# EAGLE design AutoDuctMainboard_v1.1 (EAGLE 8.5.1)
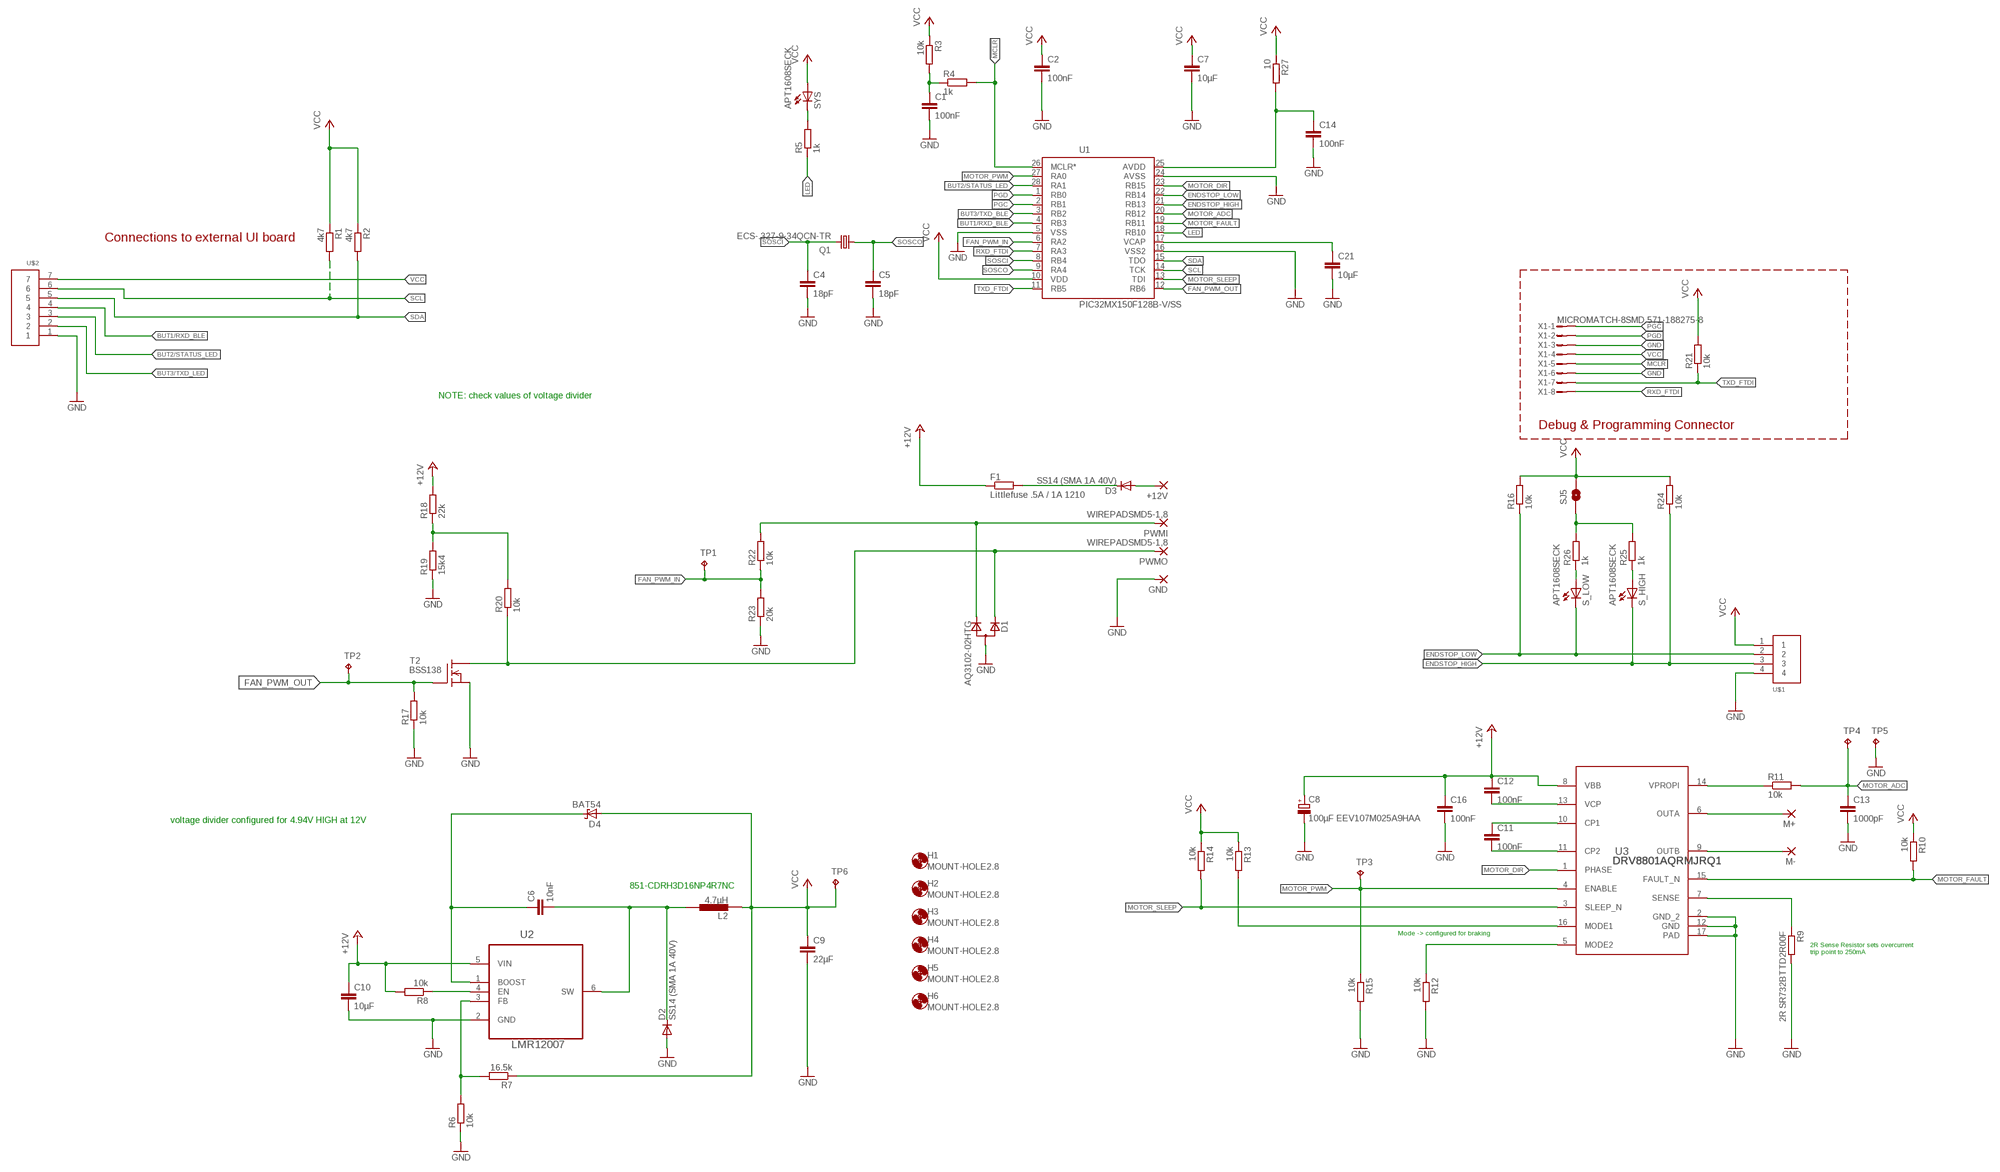
[diagram p0: schematic, sheet 1]

## Parts
+12V  SMD5  [SMD2,54-5,08]
C1  100nF  C-EUC0402  [C0402]
C2  100nF  C-EUC0402  [C0402]
C4  18pF  C-EUC0603K  [C0603K]
C5  18pF  C-EUC0603K  [C0603K]
C6  10nF  C-EUC0603K  [C0603K]
C7  10µF  C-EUC0603K  [C0603K]
C8  100µF EEV107M025A9HAA  CPOL-EU153CLV-0605  [153CLV-0605]
C9  22µF  C-EUC0805K  [C0805K]
C10  10µF  C-EUC1206K  [C1206K]
C11  100nF  C-EUC0402  [C0402]
C12  100nF  C-EUC0402  [C0402]
C13  1000pF  C-EUC0603K  [C0603K]
C14  100nF  C-EUC0402  [C0402]
C16  100nF  C-EUC0603K  [C0603K]
C21  10µF  C-EUC0603K  [C0603K]
D1  AQ3102-02HTG  D_2CSOT323  [SOT323]
D2  SS14 (SMA 1A 40V)  DIODE-DO214AC  [DO214AC]
D3  SS14 (SMA 1A 40V)  DIODE-DO214AC  [DO214AC]
D4  BAT54  [SOT23]
F1  Littlefuse .5A / 1A 1210  R-EU_R1210  [R1210]
GND  SMD5  [SMD2,54-5,08]
H1  MOUNT-HOLE2.8  [2,8]
H2  MOUNT-HOLE2.8  [2,8]
H3  MOUNT-HOLE2.8  [2,8]
H4  MOUNT-HOLE2.8  [2,8]
H5  MOUNT-HOLE2.8  [2,8]
H6  MOUNT-HOLE2.8  [2,8]
L2  4.7µH  CDRH3D16  [CDRH3D16]
M+  SMD5  [SMD2,54-5,08]
M-  SMD5  [SMD2,54-5,08]
PWMI  WIREPADSMD5-1,8  [5-1,8]
PWMO  WIREPADSMD5-1,8  [5-1,8]
Q1  ECS-.327-9-34QCN-TR  KX-327-NHF  [3.2X1.5]
R1  4k7  R-EU_R0603  [R0603]
R2  4k7  R-EU_R0603  [R0603]
R3  10k  R-EU_R0603  [R0603]
R4  1k  R-EU_R0603  [R0603]
R5  1k  R-EU_R0603  [R0603]
R6  10k  R-EU_R0603  [R0603]
R7  16.5k  R-EU_R0603  [R0603]
R8  10k  R-EU_R0603  [R0603]
R9  2R SR732BTTD2R00F  R-EU_R1206  [R1206]
R10  10k  R-EU_R0603  [R0603]
R11  10k  R-EU_R0603  [R0603]
R12  10k  R-EU_R0603  [R0603]
R13  10k  R-EU_R0603  [R0603]
R14  10k  R-EU_R0603  [R0603]
R15  10k  R-EU_R0603  [R0603]
R16  10k  R-EU_R0603  [R0603]
R17  10k  R-EU_R0603  [R0603]
R18  22k  R-EU_R0603  [R0603]
R19  15k4  R-EU_R0603  [R0603]
R20  10k  R-EU_R0603  [R0603]
R21  10k  R-EU_R0603  [R0603]
R22  10k  R-EU_R0603  [R0603]
R23  20k  R-EU_R0603  [R0603]
R24  10k  R-EU_R0603  [R0603]
R25  1k  R-EU_R0603  [R0603]
R26  1k  R-EU_R0603  [R0603]
R27  10  R-EU_R0603  [R0603]
S_HIGH  APT1608SECK  LEDCHIPLED_0603  [CHIPLED_0603]
S_LOW  APT1608SECK  LEDCHIPLED_0603  [CHIPLED_0603]
SJ5  RXLED  SOLDERJUMPERNO  [SJ_2S-NO]
SYS  APT1608SECK  LEDCHIPLED_0603  [CHIPLED_0603]
T2  BSS138  [SOT23]
TP1  TPTP13R  [TP13R]
TP2  TPTP13R  [TP13R]
TP3  TPTP13R  [TP13R]
TP4  TPTP09R  [TP09R]
TP5  TPTP12SQ  [TP12SQ]
TP6  TPTP13R  [TP13R]
U1  PIC32MX150F128B-V/SS  PIC32MX130F064B-V/ML  [QFN65P600X600X100-29N]
U2  LMR12007  [SOT95P285X100-6N]
U3  DRV8801AQRMJRQ1  [RMJ0016A]
U$1  WIREPAD1X4  [WIREPAD1X4]
U$2  WIREPAD1X7  [WIREPAD1X7]
X1  MICROMATCH-8SMD 571-188275-8  MICROMATCH-8SMD  [MICROMATCH-8-SMD]

## Nets
!MCLR: R4.2 U1.26(MCLR*) X1.5
+12V: C8.+ C10.1 C12.1 C16.1 F1.1 R8.2 R18.2 U2.5(VIN) U3.8(VBB)
BUT1/RXD_BLE: U1.4(RB3) U$2.4
BUT2/STATUS_LED: U1.28(RA1) U$2.3
BUT3/TXD_BLE: U1.3(RB2)
BUT3/TXD_LED: U$2.2
ENDSTOP_HIGH: R24.1 S_HIGH.C U1.21(RB13) U$1.3
ENDSTOP_LOW: R16.1 S_LOW.C U1.22(RB14) U$1.2
FAN_PWM_IN: R22.1 R23.2 TP1.TP U1.6(RA2)
FAN_PWM_IN_RAW: D1.3(C2) PWMI.1(P) R22.2
FAN_PWM_OUT: R17.2 T2.1(G) TP2.TP U1.12(RB6)
FAN_PWM_OUT_SHIFTED: D1.2(C1) PWMO.1(P) R20.1 T2.3(D)
GND: C1.2 C2.2 C4.2 C5.2 C7.2 C8.- C9.2 C10.2 C13.2 C14.2 C16.2 C21.2 D1.1(A) D2.A GND.1(P) R6.1 R9.2 R12.2 R15.2 R17.1 R19.1 R23.1 T2.2(S) TP5.TP U1.5(VSS) U1.16(VSS2) U1.24(AVSS) U2.2(GND) U3.2(GND_2) U3.12(GND) U3.17(PAD) U$1.4 U$2.1 X1.3 X1.6
LED: R5.1 U1.18(RB10)
MOTOR+: M+.1(P) U3.6(OUTA)
MOTOR-: M-.1(P) U3.9(OUTB)
MOTOR_ADC: C13.1 R11.2 TP4.TP U1.20(RB12)
MOTOR_DIR: U1.23(RB15) U3.1(PHASE)
MOTOR_FAULT: R10.2 U1.19(RB11) U3.15(FAULT_N)
MOTOR_PWM: R15.1 TP3.TP U1.27(RA0) U3.4(ENABLE)
MOTOR_SLEEP: R14.2 U1.13(TDI) U3.3(SLEEP_N)
N$1: R5.2 SYS.C
N$2: C1.1 R3.2 R4.1
N$3: R8.1 U2.4(EN)
N$4: C11.1 U3.10(CP1)
N$5: +12V.1(P) D3.A
N$6: C11.2 U3.11(CP2)
N$7: C6.1 D4.3(C) U2.1(BOOST)
N$8: C12.2 U3.13(VCP)
N$9: R6.2 R7.2 U2.3(FB)
N$10: C6.2 D2.C L2.2 U2.6(SW)
N$11: R13.2 U3.16(MODE1)
N$12: R12.1 U3.5(MODE2)
N$13: R25.2 R26.2 SJ5.1
N$14: R9.1 U3.7(SENSE)
N$15: R26.1 S_LOW.A
N$16: D3.C F1.2
N$18: R18.1 R19.2 R20.2
N$19: R11.1 U3.14(VPROPI)
N$20: R25.1 S_HIGH.A
N$22: C14.1 R27.2 U1.25(AVDD)
PGC: U1.2(RB1) X1.1
PGD: U1.1(RB0) X1.2
RXD_FTDI: U1.7(RA3) X1.8
SCL: R1.2 U1.14(TCK) U$2.6
SDA: R2.2 U1.15(TDO) U$2.5
SOSCI: C4.1 Q1.2 U1.8(RB4)
SOSCO: C5.1 Q1.1 U1.9(RA4)
TXD_FTDI: R21.1 U1.11(RB5) X1.7
VCAP: C21.1 U1.17(VCAP)
VCC: C2.1 C7.1 C9.1 D4.1(A) L2.1 R1.1 R2.1 R3.1 R7.1 R10.1 R13.1 R14.1 R16.2 R21.2 R24.2 R27.1 SJ5.2 SYS.A TP6.TP U1.10(VDD) U$1.1 U$2.7 X1.4

## Notes on the sheet
- Connections to external UI board
- NOTE: check values of voltage divider
- Debug & Programming Connector
- voltage divider configured for 4.94V HIGH at 12V
- 851-CDRH3D16NP4R7NC
- Mode -> configured for braking
- 2R Sense Resistor sets overcurrent
  trip point to 250mA

## Library data of the parts
+12V GND M+ M- = wirepad:SMD5: SMD PAD
C1 C2 C4-C7 C9-C14 C16 C21 = rcl:C-EU: CAPACITOR, European symbol
C8 = rcl:CPOL-EU: POLARIZED CAPACITOR, European symbol; SPICEPREFIX: C
D1 = zetex:D_2C: Dual DIODE; OC_FARNELL: unknown; OC_NEWARK: unknown
D2 D3 = diode:DIODE-: DIODE
D4 = diode:BAT54: Schottky Diodes Source: Fairchild .. BAT54.pdf
F1 = resistor:R-EU_: RESISTOR, European symbol
H1-H6 = holes:MOUNT-HOLE: MOUNTING HOLE with drill center marker
L2 = CDRH3D16:CDRH3D16: Sumida CDRH3D16 SMD Power Inductors http://www.sumida.com/products/pdf/CDRH3D16,3D16HP,3D16LD.pdf Mouser; MOUSER: CDRH3D16/LDNP-4R7NC
PWMI PWMO = wirepad:WIREPAD: Wire PAD connect wire on PCB
Q1 = crystal-geyer_V1_0:KX-327: Tuning Fork Crystals (kHz) SMD: KX327 - Serie Model Size l/w/h [mm] Frequency Range Frequency Stability Temp. Range [°C] Load Capacitance AECQ 200 availabel Datasheet KX-327VT KX-327FT KX-327RT KX-327NHT KX-327NHF KX-327L KX-327S 1.25/1.05/0.5 1.6/1.0/0.5 2.0/1.2/0.6 3.2/1.5/0.8 3.2/1.5/0.8 7.0/1.5/1.4 8.2/3.8/2.5 32,768 kHz 32,768 kHz 32,768 kHz 32,768 kHz 32,768 kHz 32,768 kHz 32,768 kHz ±10 … ±20ppm ±10 … ±20ppm ±10 … ±20ppm ±10 … ±20ppm ±10 … ±20ppm ±10 … ±20ppm ±5 … ±20ppm (*) -40°C …+85°C (*) -40°C …+85°C (*) -40°C …+85°C (*) -40°C …+85°C (*) -40°C …+125°C (*) -40°C …+85°C (*) -40°C …+85°C 7/9/12,5 7/9/12,5 7/9/12,6 7/9/12,5 9/12,5 7/9/12,5 6/12,5 - - - - yes - - KX-327VT.pdf <http://www.geyer-electronic.de/uploads/tx_userartikelfrequenz/GEYER-KX-327VT.pdf> KX-327FT.pdf <http://www.geyer-electronic.de/uploads/tx_userartikelfrequenz/GEYER-KX-327FT.pdf> KX-327RT.pdf <http://www.geyer-electronic.de/uploads/tx_userartikelfrequenz/GEYER-KX-327RT.pdf> KX-327NHT.pdf <http://www.geyer-electronic.de/uploads/tx_userartikelfrequenz/GEYER-KX-327NHT.pdf> KX-327NHF.pdf <http://www.geyer-electronic.de/uploads/tx_userartikelfrequenz/GEYER-KX-327NHF.pdf> KX-327L.pdf <http://www.geyer-electronic.de/uploads/tx_userartikelfrequenz/GEYER-KX-327L.pdf> KX-327S.pdf <http://www.geyer-electronic.de/uploads/tx_userartikelfrequenz/GEYER-KX-327S.pdf> <http://www.geyer-electronic.de/fileadmin/template/img/logo-geyer-electronic.png> Details see: http://www.geyer-electronic.de/Frequenz-Produkte.9.0.html Created 2016-06-07, Hans Locher 2016 (C) Geyer Quartz Technology KX327VT,KX327FT,KX327RT,KX327NHT,KX327NHF,KX327S,KX327L;125105;1610;2012;3215;7015;8238;1,25x1,05,1.25x1.05;1,6x1,0,1.6x1.0;2,0x1,2,2.0x1.2;3,2x1,5,3.2x1.5;8,2x3,8,8.2x3.8,7.0x1.5,7,0x1,532.768kHz
R1-R4 R10-R15 R27 = rcl:R-EU_: RESISTOR, European symbol; SPICEPREFIX: R
R5-R9 R16-R26 = rcl:R-EU_: RESISTOR, European symbol
S_HIGH S_LOW SYS = led:LED: LED OSRAM: - CHIPLED LG R971, LG N971, LY N971, LG Q971, LY Q971, LO R971, LY R971 LH N974, LH R974 LS Q976, LO Q976, LY Q976 LO Q996 - Hyper CHIPLED LW Q18S LB Q993, LB Q99A, LB R99A - SideLED LS A670, LO A670, LY A670, LG A670, LP A670 LB A673, LV A673, LT A673, LW A673 LH A674 LY A675 LS A676, LA A676, LO A676, LY A676, LW A676 LS A679, LY A679, LG A679 - Hyper Micro SIDELED® LS Y876, LA Y876, LO Y876, LY Y876 LT Y87S - SmartLED LW L88C, LW L88S LB L89C, LB L89S, LG L890 LS L89K, LO L89K, LY L89K LS L896, LA L896, LO L896, LY L896 - TOPLED LS T670, LO T670, LY T670, LG T670, LP T670 LSG T670, LSP T670, LSY T670, LOP T670, LYG T670 LG T671, LOG T671, LSG T671 LB T673, LV T673, LT T673, LW T673 LH T674 LS T676, LA T676, LO T676, LY T676, LB T676, LH T676, LSB T676, LW T676 LB T67C, LV T67C, LT T67C, LS T67K, LO T67K, LY T67K, LW E67C LS E67B, LA E67B, LO E67B, LY E67B, LB E67C, LV E67C, LT E67C LW T67C LS T679, LY T679, LG T679 LS T770, LO T770, LY T770, LG T770, LP T770 LB T773, LV T773, LT T773, LW T773 LH T774 LS E675, LA E675, LY E675, LS T675 LS T776, LA T776, LO T776, LY T776, LB T776 LHGB T686 LT T68C, LB T68C - Hyper Mini TOPLED® LB M676 - Mini TOPLED Santana® LG M470 LS M47K, LO M47K, LY M47K Source: http://www.osram.convergy.de LUXEON: - LUMILED® LXK2-PW12-R00, LXK2-PW12-S00, LXK2-PW14-U00, LXK2-PW14-V00 LXK2-PM12-R00, LXK2-PM12-S00, LXK2-PM14-U00 LXK2-PE12-Q00, LXK2-PE12-R00, LXK2-PE12-S00, LXK2-PE14-T00, LXK2-PE14-U00 LXK2-PB12-K00, LXK2-PB12-L00, LXK2-PB12-M00, LXK2-PB14-N00, LXK2-PB14-P00, LXK2-PB14-Q00 LXK2-PR12-L00, LXK2-PR12-M00, LXK2-PR14-Q00, LXK2-PR14-R00 LXK2-PD12-Q00, LXK2-PD12-R00, LXK2-PD12-S00 LXK2-PH12-R00, LXK2-PH12-S00 LXK2-PL12-P00, LXK2-PL12-Q00, LXK2-PL12-R00 Source: www.luxeon.com KINGBRIGHT: KA-3528ASYC Source: www.kingbright.com
SJ5 = SparkFun-Passives:SOLDERJUMPER: Solder Jumper Standard SMD solder jumper. Used to automate production. Two varients : Normally Open and Normally Closed are the same, but have different paste layers. NC will have a large amount of paste and should jumper during reflow.
T2 = SMD_Mosfets:BSS138
TP1-TP6 = testpad:TP: Test pad
U1 = Microchip-PIC32MX1-2-3-4-5-6-7:PIC32MX: IC,32-bit Microcontrollers (up to 128 KB Flash and 32 KB SRAM) with Audio and Graphics Interfaces, USB, and Advanced Analog; MPN: PIC32MX130F064B-V/ML; OC_FARNELL: unknown; OC_NEWARK: 73T1351; PACKAGE: 28-Lead QFN; SUPPLIER: Microchip
U2 = LMR12007:LMR12007: IC BUCK ADJ 0.3A; MPN: LM2841XMK-ADJL; OC_FARNELL: 1714819; OC_NEWARK: 10R2189; PACKAGE: TSOT23-6; SUPPLIER: National Semiconductor
U3 = DRV8801:DRV8801AQRMJRQ1; COPYRIGHT: Copyright (C) 2022 Ultra Librarian. All rights reserved.; MANUFACTURER_PART_NUMBER: DRV8801AQRMJRQ1; MFR_NAME: Texas Instruments; REFDES: RefDes; TYPE: TYPE
U$1 = wirepads:WIREPAD1X4
U$2 = wirepads:WIREPAD1X7
X1 = Con-amp-micromatch:MICROMATCH-8: MicroMaTch 8 7-215464-8 / 0-215464-8 Drawing Number C-215464 DDEController.pdf

## Net classes
2 pwr_high: width 0.152 mm, clearance 0.152 mm

## Board
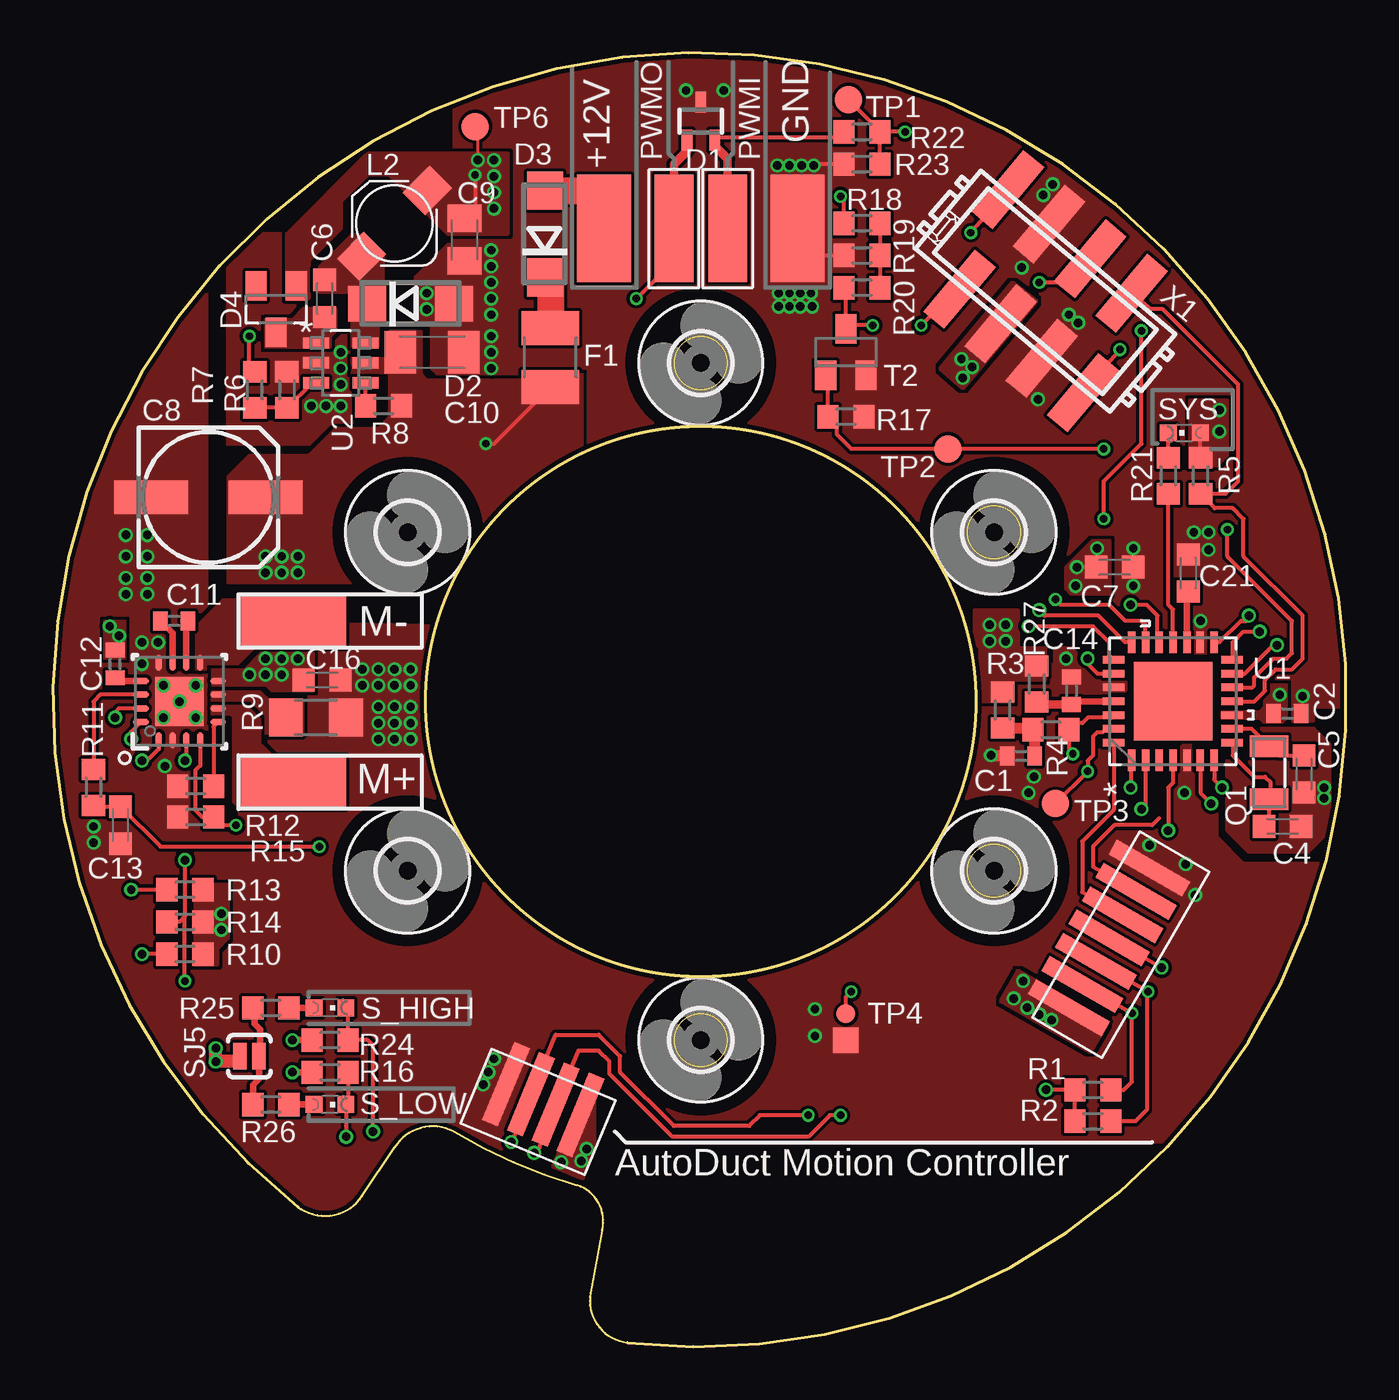
[diagram p1: board, top side]
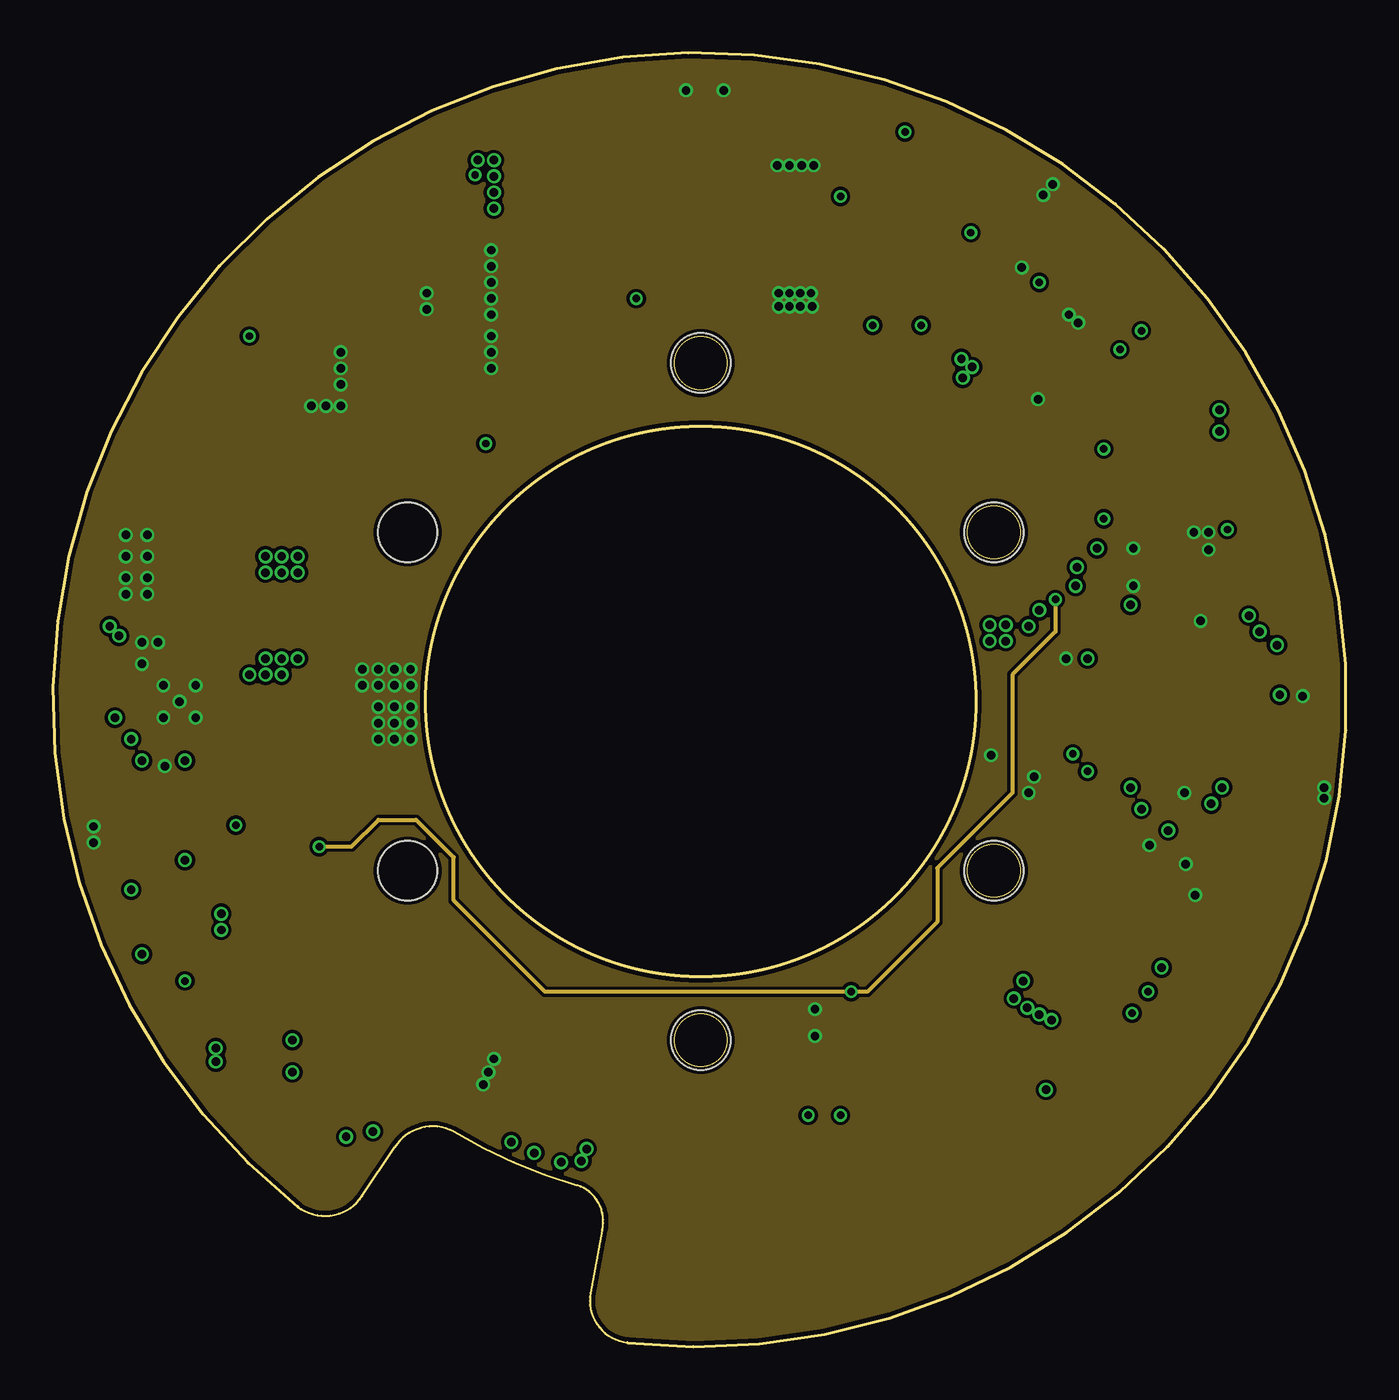
[diagram p2: board, inner layer Route2]
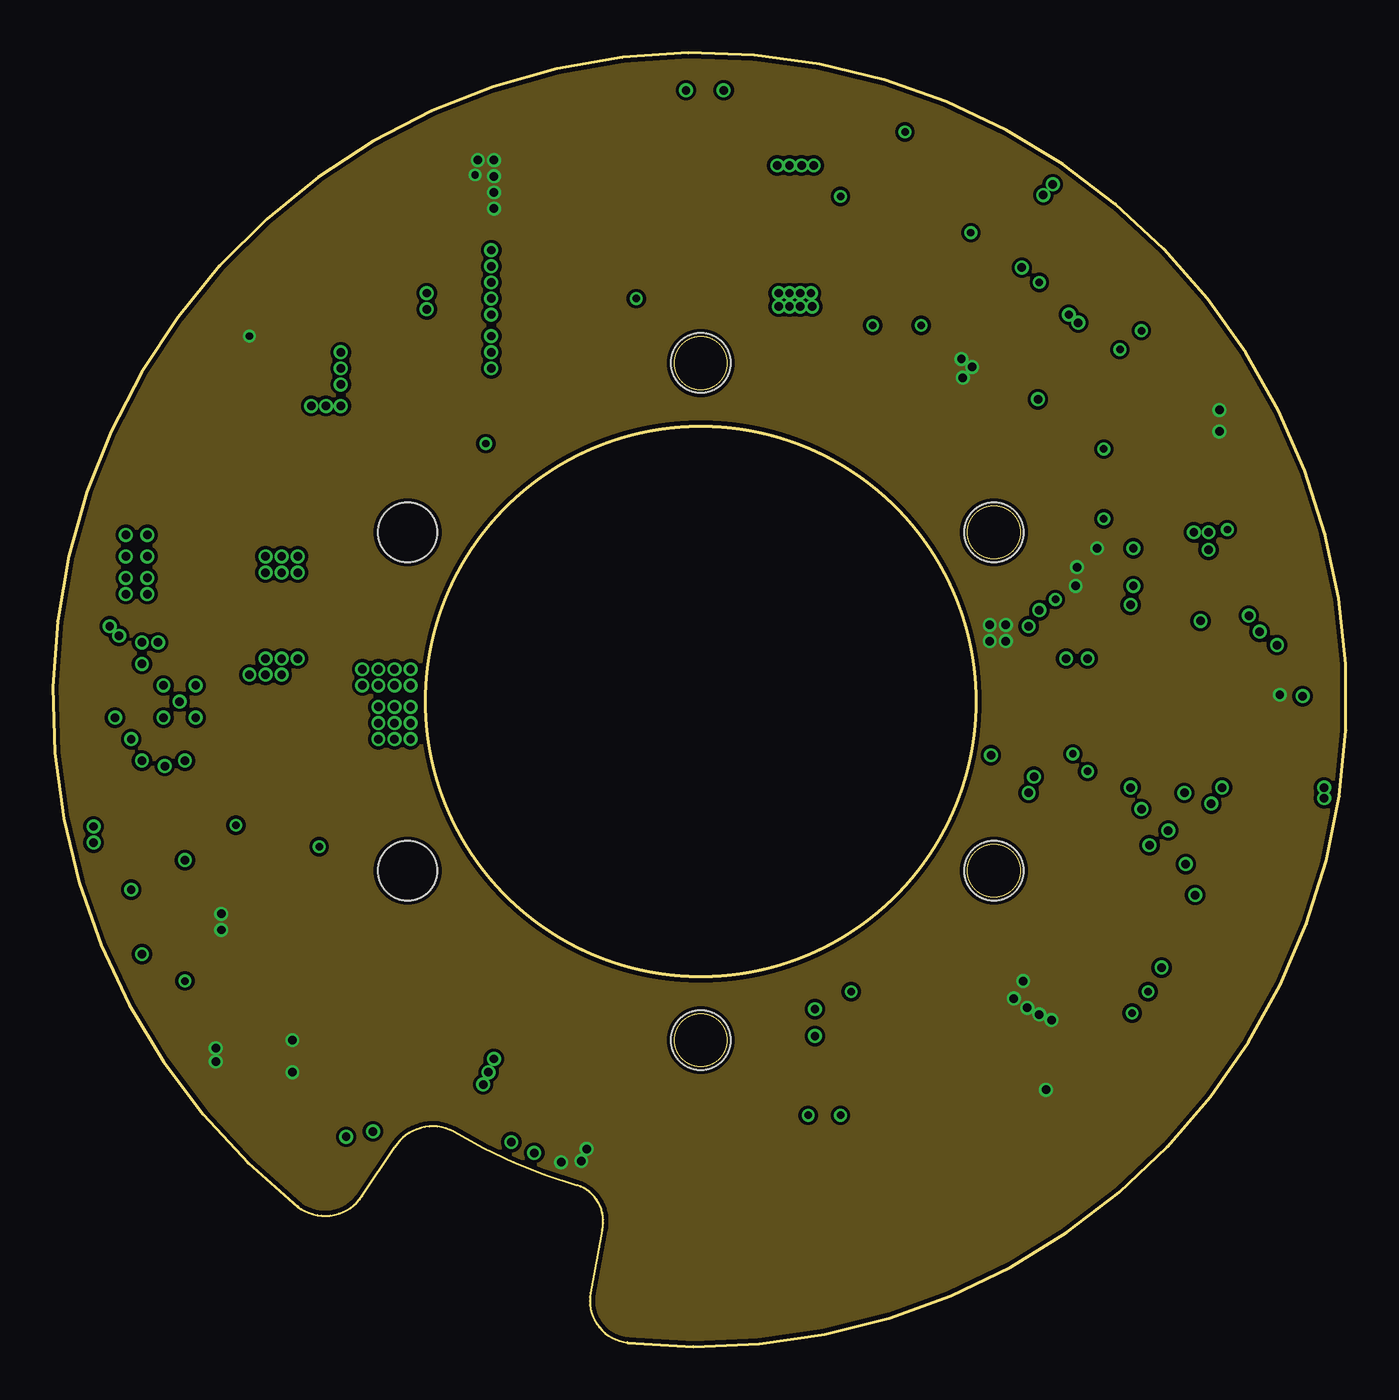
[diagram p3: board, inner layer Route15]
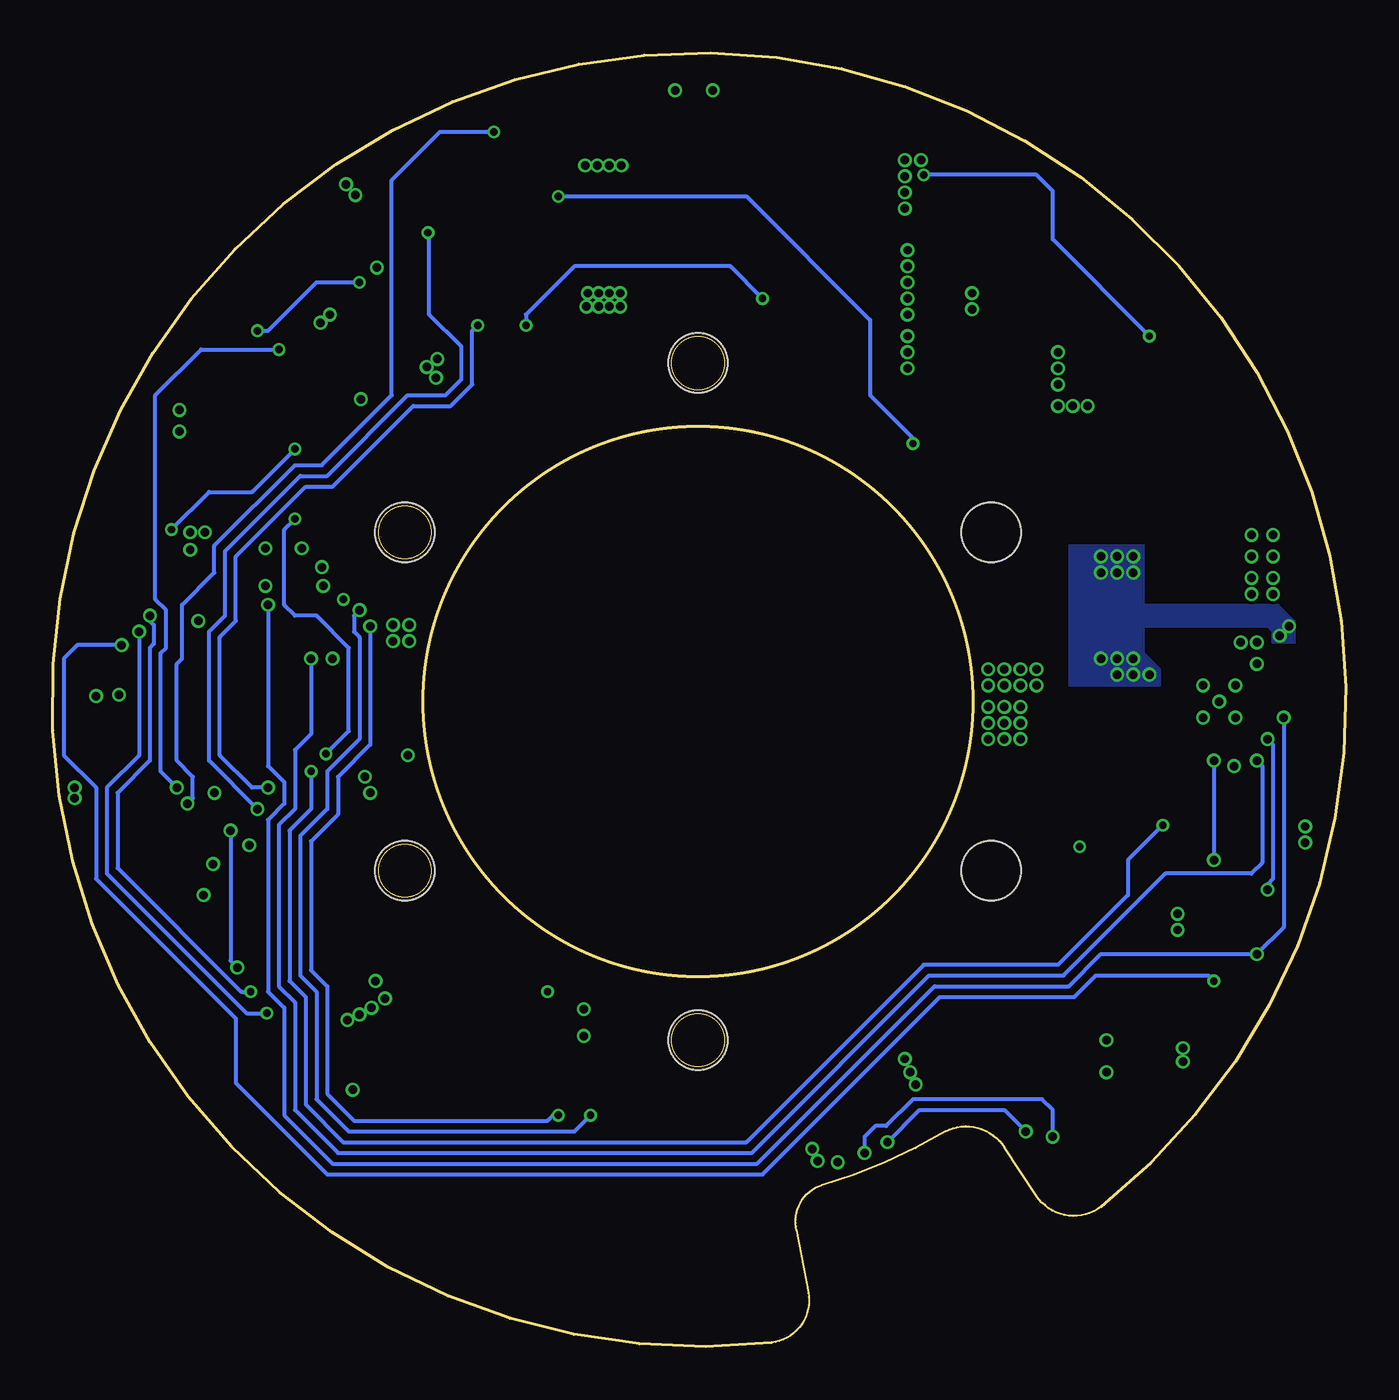
[diagram p4: board, bottom side, seen from below]

Size 61.12 x 61.15 mm. Coordinates in mm from the lower left corner, seen from the top.
Outline: 25.96,5.51 25.41,2.54 arc94 27.15,0.19 arc328 11.58,6.62 arc94 14.62,7.12 16.15,9.41 arc-86 18.94,10.17 arc15 24.78,7.63 arc-85 25.96,5.51
Outline: circle at 44.48,22.49 radius 1.25
Outline: circle at 30.63,46.49 radius 1.25
Outline: circle at 44.48,38.49 radius 1.25
Outline: circle at 30.63,14.49 radius 1.25
Outline: circle at 30.63,30.49 radius 13
Copper layers (1*2*15*16): Top 0.035mm / dielectric 0.2mm / Route2 0.0175mm / dielectric 0.465mm / Route15 0.0175mm / dielectric 0.2mm / Bottom 0.035mm
Design rules "jlcpcb-4-layer *": minimum track width 6mil, minimum drill 0.3mm, track to track 6mil, track to pad 6mil, pad to pad 6mil, via to via 6mil, smd to smd 0mil, copper to edge 0.2mm, drill to drill 6mil, minimum pad ring 5mil, minimum via ring 5mil, stop-mask expansion 3mil, vias tented up to drill 100mil, thermal gap 10mil

### Footprints (pad centres in the part's own frame; a part is rotated, then mirrored left to right if it is on the bottom)
SMD2,54-5,08 = smd 2.54 x 5.08: 1 0,0
C0402 = smd 0.7 x 0.9: 1 -0.65,0; 2 0.65,0
C0603K = smd 1.05 x 1.08: 1 -0.875,0; 2 0.875,0
153CLV-0605 = smd 3.5 x 1.6: + 2.7,0; - -2.7,0
C0805K = smd 1.3 x 1.6: 1 -1,0; 2 1,0
C1206K = smd 1.5 x 2: 1 -1.5,0; 2 1.5,0
SOT323 = smd 0.5 x 1: 1 0,0.9; 2 -0.65,-0.9; 3 0.65,-0.9
DO214AC = smd 1.8 x 1.7: A 2.05,0; C -2.05,0
SOT23 = smd 1 x 1.4: 1 -0.95,-1.1; 2 0.95,-1.1; 3 0,1.1
R1210 = smd 1.6 x 2.7: 1 -1.4,0; 2 1.4,0
2,8 = hole 2.8: 0,0
CDRH3D16 = smd 1.8 x 1.5 rotated 135: 1 1.556,-1.556; 2 -1.556,1.556
5-1,8 = smd 1.829 x 5.08: 1 0,0
3.2X1.5 = smd 1 x 1.8: 1 -1.25,0; 2 1.25,0
R0603 = smd 1 x 1.1: 1 -0.85,0; 2 0.85,0
R1206 = smd 1.6 x 1.803: 1 -1.422,0; 2 1.422,0
CHIPLED_0603 = smd 0.8 x 0.8: A 0,-0.75; C 0,0.75
SJ_2S-NO = smd 0.635 x 1.27: 1 -0.45,0; 2 0.45,0
TP13R = smd 1.3 x 1.3: TP 0,0
TP09R = smd 0.9 x 0.9: TP 0,0
TP12SQ = smd 1.2 x 1.2: TP 0,0
QFN65P600X600X100-29N = smd 1.016 x 0.356: 1 -2.794,1.956; 2 -2.794,1.295; 3 -2.794,0.66; 4 -2.794,0; 5 -2.794,-0.66; 6 -2.794,-1.295; 7 -2.794,-1.956; 15 2.794,-1.956; 16 2.794,-1.295; 17 2.794,-0.66; 18 2.794,0; 19 2.794,0.66; 20 2.794,1.295; 21 2.794,1.956 | smd 0.356 x 1.016: 8 -1.956,-2.794; 9 -1.295,-2.794; 10 -0.66,-2.794; 11 0,-2.794; 12 0.66,-2.794; 13 1.295,-2.794; 14 1.956,-2.794; 22 1.956,2.794; 23 1.295,2.794; 24 0.66,2.794; 25 0,2.794; 26 -0.66,2.794; 27 -1.295,2.794; 28 -1.956,2.794 | smd 3.708 x 3.708: 29 0,0
SOT95P285X100-6N = smd 1.219 x 0.533: 1 -1.168,0.94; 2 -1.168,0; 3 -1.168,-0.94; 4 1.168,-0.94; 5 1.168,0; 6 1.168,0.94
RMJ0016A = smd 0.75 x 0.305: 1 -1.825,0.975; 2 -1.825,0.325; 3 -1.825,-0.325; 4 -1.825,-0.975; 9 1.825,-0.975; 10 1.825,-0.325; 11 1.825,0.325; 12 1.825,0.975 | smd 0.305 x 0.75: 5 -0.975,-1.825; 6 -0.325,-1.825; 7 0.325,-1.825; 8 0.975,-1.825; 13 0.975,1.825; 14 0.325,1.825; 15 -0.325,1.825; 16 -0.975,1.825 | smd 2.3 x 2.3: 17 0,0
WIREPAD1X4 = smd 4 x 0.8: 1 0,1.27; 2 0,0; 3 0,-1.27; 4 0,-2.54
WIREPAD1X7 = smd 4 x 0.8: 1 0,3.81; 2 0,2.54; 3 0,1.27; 4 0,0; 5 0,-1.27; 6 0,-2.54; 7 0,-3.81
MICROMATCH-8-SMD = smd 1.27 x 3.81: 1 4.445,-2.54; 2 3.175,2.54; 3 1.905,-2.54; 4 0.635,2.54; 5 -0.635,-2.54; 6 -1.905,2.54; 7 -3.175,-2.54; 8 -4.445,2.54

### Placement (x,y rotation side)
+12V  26.05,52.84 0 top
C1  45.76,27.92 180 top
C2  58.35,29.93 0 top
C4  58.12,24.59 0 top
C5  59.14,27.06 270 top
C6  12.85,49.54 90 top
C7  50.18,36.84 0 top
C8  7.35,40.14 0 top
C9  19.46,52.32 270 top
C10  17.93,47 0 top
C11  5.73,34.3 180 top
C12  2.94,32.27 270 top
C13  3.19,24.65 270 top
C14  48.15,31 90 top
C16  12.73,31.51 0 top
C21  53.67,36.57 90 top
D1  30.63,57.92 0 top
D2  16.91,49.29 0 top
D3  23.26,52.59 90 top
D4  10.56,49.03 180 top
F1  23.51,46.75 90 top
GND  35.2,52.84 0 top
H1  44.48,22.49 0 top
H2  44.48,38.49 0 top
H3  30.63,46.49 0 top
H4  16.77,38.49 0 top
H5  16.77,22.49 0 top
H6  30.63,14.49 0 top
L2  16.15,53.1 90 top
M+  11.32,26.68 270 top
M-  11.32,34.3 90 top
PWMI  31.9,52.84 0 top
PWMO  29.36,52.84 0 top
Q1  57.49,27.13 270 top
R1  49.16,12.13 0 top
R2  49.16,10.66 0 top
R3  44.89,30.09 270 top
R4  47.18,29.16 0 top
R5  52.72,41.16 90 top
R6  11.07,45.22 270 top
R7  9.54,45.22 270 top
R8  15.64,44.46 0 top
R9  12.44,29.73 0 top
R10  6.24,18.55 180 top
R11  1.92,26.43 270 top
R12  6.75,26.49 180 top
R13  6.24,21.6 180 top
R14  6.24,20.08 180 top
R15  6.75,25.03 180 top
R16  13.1,12.97 180 top
R17  37.48,43.95 180 top
R18  38.25,53.1 180 top
R19  38.25,51.57 0 top
R20  38.25,50.05 0 top
R21  54.25,41.16 90 top
R22  38.25,57.42 180 top
R23  38.25,55.89 0 top
R24  13.1,14.49 180 top
R25  10.31,16.01 180 top
R26  10.31,11.44 180 top
R27  46.5,31.32 270 top
S_HIGH  13.1,16.01 270 top
S_LOW  13.1,11.44 270 top
SJ5  9.29,13.73 180 top
SYS  53.49,43.19 90 top
T2  37.48,47 0 top
TP1  37.61,58.94 0 top
TP2  42.31,42.43 0 top
TP3  47.39,25.67 0 top
TP4  37.48,15.74 0 top
TP5  37.48,14.49 0 top
TP6  19.96,57.67 0 top
U1  52.94,30.5 90 top
U2  13.61,46.49 0 top
U3  5.99,30.49 90 top
U$1  23.77,11.44 247.5 top
U$2  49.93,19.32 330 top
X1  46.92,49.89 140 top

### Tracks (layer width: path | path; a pad name or v marks a point on that pad's centre or on a via)
!MCLR  (via drill 0.35)
  Top 0.15: 48.35,29.48 R4.2
  Top 0.2: U1.26 50.03,29.73 48.91,29.73 48.66,29.48 48.35,29.48 | R4.2 48.03,28.2 v48.22,28.02 | v49.68,39.13 49.68,40.91 51.45,42.68 v51.45,48.02 | v46.63,50.3 48.15,50.3 49.04,51.19 X1.5
  Bottom 0.2: v48.22,28.02 47.14,29.1 47.14,33.03 48.66,34.56 49.68,34.56 50.18,35.06 50.18,38.62 v49.68,39.13 | v51.45,48.02 50.95,48.02 48.66,50.3 v46.63,50.3
+12V  (via drill 0.35, 0.4)
  Top 0.2: R18.2 37.4,54.2 v37.23,54.37 | v20.47,42.68 20.85,42.68 F1.1
  Bottom 0.2: v20.47,42.68 20.47,42.94 22.5,44.97 22.5,48.53 28.34,54.37 v37.23,54.37
  other vias: 10.05,32.52 10.81,32.52 11.58,32.52 10.05,31.76 10.81,31.76 10.05,36.59 10.81,36.59 11.58,36.59 11.58,37.35 10.81,37.35 10.05,37.35 9.29,31.76 2.69,34.05 3.13,33.6
  pour Top (rank 2, no thermals): 14.12,46.75 15.89,46.75 15.89,48.02 17.42,48.02 17.42,45.99 17.67,45.73 22.5,45.73 22.75,45.99 25.04,45.99 25.04,41.92 20.21,36.84 19.2,36.84 18.43,36.08 8.27,36.08 8.27,41.16 9.29,42.18 12.08,42.18 13.35,43.45 15.39,43.45 15.89,43.95 15.89,45.99 14.12,45.99
  pour Top (no thermals): 7.51,32.02 7.51,31.25 10.05,31.25 10.31,31 12.34,31 12.34,32.78 9.8,32.78 9.04,32.02
  pour Bottom (no thermals): 9.54,37.86 13.1,37.86 13.1,31.25 8.78,31.25 8.78,32.02 9.54,32.78
  pour Top (rank 2, no thermals): 2.43,32.52 2.43,34.3 3.45,34.3 3.45,32.52
  pour Bottom (no thermals): 2.43,33.29 2.43,34.3 3.19,35.06 10.81,35.06 10.81,34.05 3.7,34.05 3.45,33.79 3.45,33.29
BUT1/RXD_BLE  (via drill 0.4)
  Top 0.2: U1.4 52.94,26.65 52.72,26.43 v52.72,24.4 | v52.41,17.92 U$2.4
  Bottom 0.2: v52.72,24.4 52.72,18.24 v52.41,17.92
BUT2/STATUS_LED
  Top 0.2: U1.28 50.15,25.38 48.66,23.89 48.66,21.48 U$2.3
BUT3/TXD_LED
  Top 0.2: 52.28,24.97 51.96,24.65 50.18,24.65 49.17,23.63 49.17,22.68 U$2.2
ENDSTOP_HIGH  (via drill 0.35, 0.4)
  Top 0.2: v21.67,9.66 U$1.3 23.77,14.74 25.8,14.74 26.82,13.73 26.82,12.97 29.36,10.43 32.91,10.43 33.42,10.93 v35.71,10.93 | v15.13,10.17 15.13,14.24 14.88,14.49 R24.1 13.95,15.91 S_HIGH.C | U1.21 50.68,33.3 49.42,34.56 46.88,34.56 v46.63,34.81
  Bottom 0.2: v21.67,9.66 20.15,11.19 16.15,11.19 v15.13,10.17 | v46.63,34.81 46.88,34.56 46.88,33.79 46.63,33.54 46.63,28.71 48.15,27.19 48.15,25.41 49.42,24.14 49.42,17.54 48.66,16.78 48.66,11.7 47.14,10.17 36.47,10.17 v35.71,10.93
ENDSTOP_LOW  (via drill 0.35, 0.4)
  Top 0.2: U1.22 49.93,32.68 49.93,33.29 49.17,34.05 v46.12,34.05 | v13.86,9.92 13.85,10.44 S_LOW.C 13.95,11.54 R16.1 | v22.75,9.16 23.01,9.41 U$1.2 24.85,13.98 25.8,13.98 26.31,13.47 26.31,12.9 29.29,9.92 35.71,9.92 36.72,10.93 v37.23,10.93
  Bottom 0.2: v13.86,9.92 13.86,11.19 14.37,11.7 20.47,11.7 21.74,10.43 22.24,10.43 22.75,9.92 v22.75,9.16 | v46.12,34.05 46.12,28.46 47.64,26.94 47.64,25.16 48.91,23.89 48.91,17.79 48.15,17.03 48.15,11.95 46.88,10.68 37.74,10.68 37.48,10.93 v37.23,10.93
FAN_PWM_IN  (via drill 0.35, 0.4)
  Top 0.2: U1.6 54.25,27.7 54.25,26.17 v54.76,25.67 | v40.28,57.42 R22.1 | R23.2 R22.1 | TP1.TP 39.1,57.46 R22.1
  Bottom 0.2: v54.76,25.67 54.5,25.92 54.5,26.94 55.26,27.7 55.26,32.27 55.01,32.52 55.01,35.06 53.49,36.59 53.49,37.86 49.68,41.67 48.41,41.67 45.1,44.97 45.1,55.13 42.82,57.42 v40.28,57.42
FAN_PWM_IN_RAW
  Top 0.2: D1.3 31.4,57.16 37.14,57.16 R22.2
  Top 0.406: PWMI.1 31.9,56.15 31.28,56.77 D1.3
FAN_PWM_OUT  (via drill 0.35)
  Top 0.2: U1.12 56.7,31.16 56.79,31.25 56.79,31.64 57.68,32.52 58.31,32.52 58.57,32.78 58.57,34.3 55.52,37.35 v55.52,38.62 | v49.68,42.43 TP2.TP 37.74,42.43 37.06,43.1 37.06,43.52 R17.2 36.63,45.8 T2.1
  Bottom 0.2: v55.52,38.62 53.74,40.4 51.71,40.4 v49.68,42.43
FAN_PWM_OUT_SHIFTED  (via drill 0.35)
  Top 0.2: T2.3 37.48,48.27 | 37.48,48.27 37.48,49.96 R20.1 | v38.75,48.27 37.48,48.27 | v27.58,49.54 29.36,51.32 PWMO.1
  Top 0.406: PWMO.1 29.36,55.89 29.98,56.51 D1.2
  Bottom 0.2: v27.58,49.54 29.1,51.07 36.47,51.07 38.75,48.78 v38.75,48.27
GND  (via drill 0.4)
  Top 0.2: R19.1 35.71,51.57 35.71,52.08 GND.1 | R23.1 36.02,55.89 v35.96,55.83
  Top 0.508: v44.34,27.95 45.07,27.95 C1.2
  other vias: 13.61,46.24 13.61,45.48 20.72,50.3 20.72,49.54 20.72,48.78 20.72,47.76 20.72,47 20.72,46.24 20.72,51.83 20.72,51.07 5.23,31.25 5.23,29.73 6.75,29.73 6.75,31.25 5.99,30.49 5.29,27.44 4.21,32.27 4.97,33.29 4.21,33.29 14.62,32.02 14.62,31.25 15.39,30.24 15.39,29.48 15.39,32.02 15.39,31.25 15.39,28.71 3.45,38.37 4.46,38.37 4.46,37.35 3.45,37.35 3.45,36.33 4.46,36.33 4.46,35.57 3.45,35.57 47.9,32.52 60.09,26.43 60.09,25.92 59.07,30.75 54.25,34.3 54.63,37.67 53.93,38.49 53.49,26.17 51.07,37.73 51.07,35.95 51.83,23.7 53.55,22.81 17.67,49.8 17.67,49.03 54.63,38.49 48.02,48.78 48.47,48.4 47.26,54.94 46.82,54.43 45.8,51 46.56,44.78 34.31,49.8 34.82,49.8 35.32,49.8 35.83,49.8 34.31,49.16 34.82,49.16 35.32,49.16 35.9,49.16 34.24,55.83 34.82,55.83 35.39,55.83 20.85,13.6 20.59,12.97 20.34,12.39 1.92,24.59 1.92,23.82 53.99,21.35 29.93,59.38 31.7,59.38 13.61,44.46 12.91,44.46 12.21,44.46 13.61,47 16.15,32.02 16.15,31.25 16.91,32.02 16.91,31.25 16.15,30.24 16.91,30.24 16.91,29.48 16.15,29.48 16.15,28.71 16.91,28.71 36.02,14.68 36.02,15.95 46.37,26.94 46.12,26.17
  pour Top (no thermals): 2.94,40.84 2.94,35.32 3.7,34.56 3.7,31.76 4.72,31.76 4.72,29.48 4.84,29.35 5.29,29.35 5.29,27.76 5.03,27.51 5.03,25.54 6.3,25.54 6.3,27.19 5.86,27.63 5.86,29.29 5.92,29.35 7.07,29.35 7.07,31.51 7,31.57 5.35,31.57 5.23,31.7 5.23,33.41 6.05,33.35 6.05,38.11 6.75,38.62 6.75,40.4 6.37,40.84
  pour Top (rank 5, no thermals): -0.87,53.1 7.26,53.1 7.26,34.3 31.13,33.79 31.13,16.52 -0.87,17.03
  pour Top (no thermals): 56.53,29.22 59.58,29.22 60.34,28.46 60.34,25.16 60.34,24.4 59.33,23.38 56.53,23.38 55.77,24.14 55.52,24.4 55.52,27.7 56.53,28.71
  pour Top (rank 4, no thermals): 58.57,31.25 58.57,29.6 59.58,29.6 59.58,31.25
  pour Top (no thermals): 52.98,32.78 52.98,38.87 55.01,38.87 55.01,34.3 54.5,33.79 54.5,32.78
  pour Top (no thermals): 18.69,52.08 21.48,52.08 21.48,45.99 18.18,45.99 17.93,46.24 17.93,48.02 17.93,48.27 17.67,48.53 17.16,48.53 17.16,50.56
  pour Top (rank 3, no thermals): 8.27,52.59 8.27,42.68 14.12,42.68 14.12,47.76 13.35,47.76 13.35,52.59
  pour Top (rank 3, no thermals): 47.39,33.03 48.15,33.03 49.68,31.51 50.69,31.51 50.69,31 47.39,31
  pour Top (rank 3, no thermals): 50.44,38.11 50.44,35.57 51.71,35.57 51.71,38.11
  pour Top (rank 3, no thermals): 53.49,28.46 53.74,28.46 53.74,27.19 53.99,26.94 53.99,25.67 52.98,25.67 52.98,26.43 53.23,26.68 53.23,28.21
  pour Top (rank 3, no thermals): 51.45,24.14 50.95,23.63 50.95,22.87 51.71,22.87 52.72,21.86 53.23,21.86 53.23,21.09 54.5,21.09 54.5,24.14
  pour Route2 (rank 3, no thermals): 0.15,62.5 43.07,62.5 63.39,42.18 63.39,19.32 44.09,0.01 44.09,-1 17.93,-1 -2.65,19.57 -2.65,59.7
  pour Top (rank 3, no thermals): 34.05,56.4 34.05,48.53 35.96,48.53 36.47,49.03 36.47,55.89 35.96,56.4
  pour Top (rank 3, no thermals): 47.14,55.38 48.66,54.05 45.8,50.62 44.79,51.51 46.5,53.54 46.5,54.69
  pour Top (rank 3, no thermals): 45.1,45.73 46.69,44.4 47.2,44.97 47.2,46.24 49.04,48.4 48.09,49.29
  pour Top (rank 3, no thermals): 20.72,13.98 21.99,13.47 20.97,10.93 19.7,11.44
  pour Top (rank 3, no thermals): 29.36,59.96 32.15,59.96 32.15,58.18 29.36,58.18
  pour Top (rank 3, no thermals): 35.45,17.28 38.5,17.28 38.5,13.98 35.45,13.98
  pour Top (rank 6, no thermals): 43.83,32.27 49.42,32.27 49.93,31.76 49.93,27.19 53.74,27.19 55.01,25.92 55.01,24.14 56.28,22.87 61.36,22.87 61.36,9.66 25.8,9.66 20.47,4.33 12.59,4.33 -0.36,17.28 20.72,17.28 35.45,32.02 43.58,32.02
  pour Top (rank 6, no thermals): 18.94,61.99 18.94,43.95 28.34,34.56 41.29,34.56 42.31,33.54 55.77,33.54 57.3,32.02 57.3,30.49 57.55,30.24 63.9,30.24 63.9,61.23 63.14,61.99
LED
  Top 0.2: U1.18 52.94,34.85 52.72,35.06 R5.1
MOTOR+
  pour Top (no thermals): 7.51,30.3 9.16,30.3 9.8,29.67 9.8,28.52 10.69,27.63 11.51,27.63 11.64,27.51 11.64,25.6 11.51,25.48 8.78,25.48 8.53,25.73 8.53,29.73 8.4,29.86 7.51,29.86
MOTOR-
  pour Top (rank 2, no thermals): 7.26,32.02 7.26,32.27 8.78,32.27 9.8,33.29 12.59,33.29 12.59,35.32 8.02,35.32 6.75,34.05 6.75,32.02
MOTOR_ADC  (via drill 0.35)
  Top 0.2: U1.20 51.65,34.11 51.45,34.3 50.69,34.3 49.93,35.06 47.64,35.06 v47.39,35.32 | R11.2 1.98,25.53 C13.1 5.08,23.63 v12.59,23.63 | v37.74,16.78 37.48,16.52 TP4.TP
  Route2 0.2: v47.39,35.32 47.39,33.79 45.36,31.76 45.36,26.17 41.8,22.62 41.8,20.08 38.5,16.78 v37.74,16.78 23.26,16.78 18.94,21.09 18.94,23.13 17.16,24.9 15.39,24.9 14.12,23.63 v12.59,23.63
MOTOR_DIR  (via drill 0.4)
  Top 0.2: U3.1 5.01,28.25 4.46,27.7 v4.21,27.7 | U1.23 49.39,31.8 48.91,32.27 v48.91,32.52
  Bottom 0.2: v4.21,27.7 3.96,27.44 3.96,22.87 4.46,22.36 8.53,22.36 13.35,17.54 19.7,17.54 28.09,9.16 47.64,9.16 49.68,11.19 49.68,16.27 50.44,17.03 50.44,24.65 49.68,25.41 49.68,28.21 48.91,28.97 v48.91,32.52
MOTOR_FAULT  (via drill 0.4)
  Top 0.2: U3.15 3.12,30.17 2.94,29.98 v2.94,29.73 | R10.2 v4.21,18.55 | U1.19 52.22,33.36 52.22,34.56 51.71,35.06 v50.95,35.06
  Bottom 0.2: v2.94,29.73 2.94,19.82 v4.21,18.55 11.58,18.55 13.1,17.03 19.45,17.03 27.83,8.65 47.9,8.65 50.18,10.93 50.18,16.01 50.95,16.78 50.95,24.9 50.18,25.67 50.18,26.68 50.95,27.44 v50.95,35.06
MOTOR_PWM  (via drill 0.35)
  Top 0.2: U3.4 6.96,27.47 6.75,27.25 6.75,25.35 7.07,25.03 R15.1 7.98,24.65 v8.65,24.65 | U1.27 49.79,29.21 49.61,29.03 49.36,29.03 49.17,28.84 49.17,27.95 48.91,27.7 v48.91,27.19 TP3.TP
  Bottom 0.2: v48.91,27.19 48.91,25.41 49.93,24.4 49.93,17.28 49.17,16.52 49.17,11.44 47.39,9.66 28.34,9.66 19.96,18.05 13.61,18.05 10.31,21.35 10.31,23 v8.65,24.65
MOTOR_SLEEP  (via drill 0.35, 0.4)
  Top 0.2: U3.3 6.31,28.02 6.24,27.95 v6.24,27.7 | v6.24,23 6.24,20.33 | 6.24,20.33 5.99,20.08 R14.2 | U1.13 56.31,31.8 57.68,33.16 v57.87,33.16 | v6.24,17.28 6.24,20.33
  Bottom 0.2: v6.24,27.7 v6.24,23 | v57.87,33.16 59.96,33.16 60.6,32.52 60.6,27.95 59.07,26.43 59.07,22.11 52.47,15.51 52.47,12.46 48.15,8.14 27.58,8.14 19.2,16.52 12.85,16.52 11.83,17.54 6.5,17.54 v6.24,17.28
N$1
  Top 0.2: R5.2 52.72,43.18 SYS.C
N$2
  Top 0.508: R3.2 46.25,29.24 R4.1 46.41,29.08 C1.1
N$3
  Top 0.2: R8.1 14.79,45.54 U2.4
N$4
  Top 0.305: U3.10 6.31,34.23 C11.1
N$5
  Top 1.27: D3.A 25.53,54.64 26.05,54.11 +12V.1
N$6
  Top 0.305: U3.11 5.66,33.72 C11.2
N$7
  pour Top (no thermals): 10.05,48.53 10.05,47.26 13.1,47.26 13.1,47.76 13.35,48.02 13.35,49.03 11.83,49.03 11.32,48.53
N$8
  Top 0.305: U3.13 3.09,31.47 C12.2
N$9
  Top 0.2: U2.3 12.25,45.55 R6.2 R7.2
N$10
  pour Top (no thermals): 14.12,47.26 14.12,49.8 12.59,49.8 12.59,51.07 14.12,52.59 14.62,52.59 15.64,51.57 15.64,48.53 15.39,48.53 15.39,47.26
N$11  (via drill 0.4)
  Top 0.2: U3.16 3.7,29.06 v3.7,28.71 | v3.7,21.6 R13.2
  Bottom 0.2: v3.7,28.71 3.45,28.46 3.45,22.11 3.7,21.86 v3.7,21.6
N$12
  Top 0.2: U3.5 7.6,29.3 R12.1
N$13
  Top 0.305: R26.2 9.46,12.37 9.74,12.65 SJ5.1 9.8,13.79 9.8,15 9.54,15.25 9.54,15.93 R25.2
N$14
  pour Top (rank 2, no thermals): 7.51,31 9.8,31 10.31,30.49 11.83,30.49 11.83,28.97 10.05,28.97 10.05,29.73 9.29,30.49 7.51,30.49
N$15
  Top 0.305: S_LOW.A R26.1
N$16
  Top 1.27: D3.C 23.51,50.29 F1.2
N$18
  Top 0.2: R18.1 R19.2 R20.2
N$19
  Top 0.2: U3.14 2.25,30.82 1.92,30.49 R11.1
N$20
  Top 0.305: S_HIGH.A R25.1
N$22
  Top 0.305: U1.25 48.29,30.49 C14.1
  Top 0.406: C14.1 46.62,30.35 R27.2
PGC  (via drill 0.35, 0.4)
  Top 0.2: U1.2 51.65,25.6 v51.45,25.41 | v43.39,52.65 X1.1
  Bottom 0.2: v51.45,25.41 53.74,27.7 53.74,33.79 52.98,34.56 52.98,37.6 49.42,41.16 48.15,41.16 44.34,44.97 42.56,44.97 41.8,45.73 41.8,47.26 43.33,48.78 43.33,52.59 v43.39,52.65
PGD  (via drill 0.35, 0.4)
  Top 0.2: U1.1 50.95,27.67 v50.95,26.43 | v41.04,48.27 X1.2
  Bottom 0.2: v50.95,26.43 51.71,26.43 53.23,27.95 53.23,33.54 52.47,34.3 52.47,37.35 49.17,40.65 47.9,40.65 44.09,44.46 42.31,44.46 41.29,45.48 41.29,48.02 v41.04,48.27
RXD_FTDI  (via drill 0.35, 0.4)
  Top 0.2: U1.7 54.9,26.8 v55.26,26.43 | v50.44,47.13 X1.8
  Bottom 0.2: v55.26,26.43 56.03,27.19 56.03,32.78 55.77,33.03 55.77,34.81 56.28,35.32 56.28,44.97 54.12,47.13 v50.44,47.13
SCL  (via drill 0.35, 0.4)
  Top 0.2: U1.14 55.77,32.5 55.77,33.29 56.28,33.79 v57.04,33.79 | U$2.6 v51.01,15.76 51.01,12.52 50.62,12.13 R1.2
  Bottom 0.2: v57.04,33.79 57.04,27.95 58.57,26.43 58.57,22.36 51.96,15.76 v51.01,15.76
SDA  (via drill 0.35, 0.4)
  Top 0.2: U1.15 55.15,33.3 56.15,34.3 56.41,34.3 56.53,34.43 v56.53,34.56 | U$2.5 v51.77,16.78 51.71,16.71 51.71,11.19 51.18,10.66 R2.2
  Bottom 0.2: v56.53,34.56 56.53,34.3 56.34,34.11 56.34,33.22 56.53,33.03 56.53,27.7 58.06,26.17 58.06,22.62 52.22,16.78 v51.77,16.78
SOSCI
  Top 0.2: U1.8 55.77,28.51 55.77,27.95 56.79,26.94 57.3,26.94 57.55,26.68 57.55,25.94 Q1.2 57.49,24.83 C4.1
SOSCO
  Top 0.2: U1.9 56.66,29.21 Q1.1 57.92,27.94 C5.1
TXD_FTDI
  Top 0.2: U1.11 56.8,30.5 57.3,31 57.3,31.51 57.8,32.02 58.57,32.02 59.07,32.52 59.07,34.56 56.28,37.35 56.28,39.13 55.77,39.64 54.92,39.64 R21.1 55.43,40.31 56.03,40.91 56.03,45.48 52.47,49.03 51.9,49.03 X1.7
VCAP
  Top 0.305: U1.17 53.6,35.62 C21.1
VCC  (via drill 0.35, 0.4)
  Top 0.152: TP6.TP 20.08,57.54 v20.08,56.08
  Top 0.2: R7.1 9.29,46.33 v9.29,47.76 | v19.96,55.38 19.96,53.82 C9.1 | R21.2 54.25,43.18 SYS.A | R2.1 R1.1 48.3,12.14 v46.95,12.14
  Top 0.305: R24.2 v11.32,14.49 | R16.2 v11.32,12.97
  Top 0.61: SJ5.2 8.59,13.47 v7.7,13.47 v7.7,14.11
  Bottom 0.2: v9.29,47.76 13.86,52.34 13.86,54.62 14.62,55.38 v19.96,55.38
  other vias: 57.99,30.81 44.28,33.35 44.28,34.11 45.04,34.11 45.04,33.35 48.34,35.95 48.41,36.84 49.36,37.73 42.94,46.68 43.45,46.3 43.01,45.8 7.96,20.46 7.96,19.7 25.23,9.35 24.97,8.78 24.02,8.71 45.87,17.28 47.2,15.44 46.63,15.7 46.06,16.01 45.42,16.46 20.85,53.8 20.85,54.56 20.85,55.32 20.85,56.08 55.14,44.27 55.14,43.26
  pour Top (rank 2, no thermals): 55.26,29.98 55.26,29.73 57.04,29.73 57.3,29.48 58.06,29.48 58.31,29.73 58.31,31.25 57.3,31.25 57.3,30.24 57.04,29.98
  pour Top (no thermals): 11.07,49.54 11.07,52.59 14.88,56.4 21.48,56.4 21.48,52.59 18.69,52.59 15.89,55.38 14.88,55.38 13.61,54.11 13.61,52.84 12.08,51.32 12.08,49.54
  pour Top (rank 3, no thermals): 43.58,34.81 45.61,34.81 45.61,33.03 46.88,33.03 46.88,31.51 45.36,31.51 45.36,30.49 43.83,30.49 43.83,33.03 43.58,33.29
  pour Top (rank 3, no thermals): 49.93,38.11 49.93,35.57 48.15,35.57 47.9,35.83 47.9,36.84 49.17,38.11
  pour Route15 (rank 3, no thermals): 0.15,61.23 43.83,61.23 61.87,43.19 61.87,17.79 42.82,-1.26 17.67,-1.26 -2.65,19.06 -2.65,58.43
  pour Top (rank 3, no thermals): 45.36,50.3 41.93,46.24 43.01,45.29 46.5,49.42
  pour Top (rank 3, no thermals): 53.74,44.72 53.74,41.67 55.01,41.67 55.52,42.18 55.52,44.72
  pour Top (rank 3, no thermals): 45.61,17.79 49.87,15.32 49.04,13.92 44.79,16.33
  pour Top (rank 3, no thermals): 24.53,10.68 23.64,8.52 25.04,7.95 25.61,9.35 25.61,11.76 25.1,12.01
  pour Top (rank 3, no thermals): 6.75,21.86 8.27,21.86 8.27,19.32 7.77,18.81 7.77,18.05 6.75,18.05

### Text on the board
tPlace: AutoDuct Motion Controller
tDocu: GND / S_HIGH / S_LOW / +3V3 | GND / BUT3 / BUT2 / BUT1 / SDA / SCL / +3V3 | HW-Rev. 1.1 | 2022-07-23 / by Daniel Porzig